# Altium schematic sheet root.SchDoc
size A4
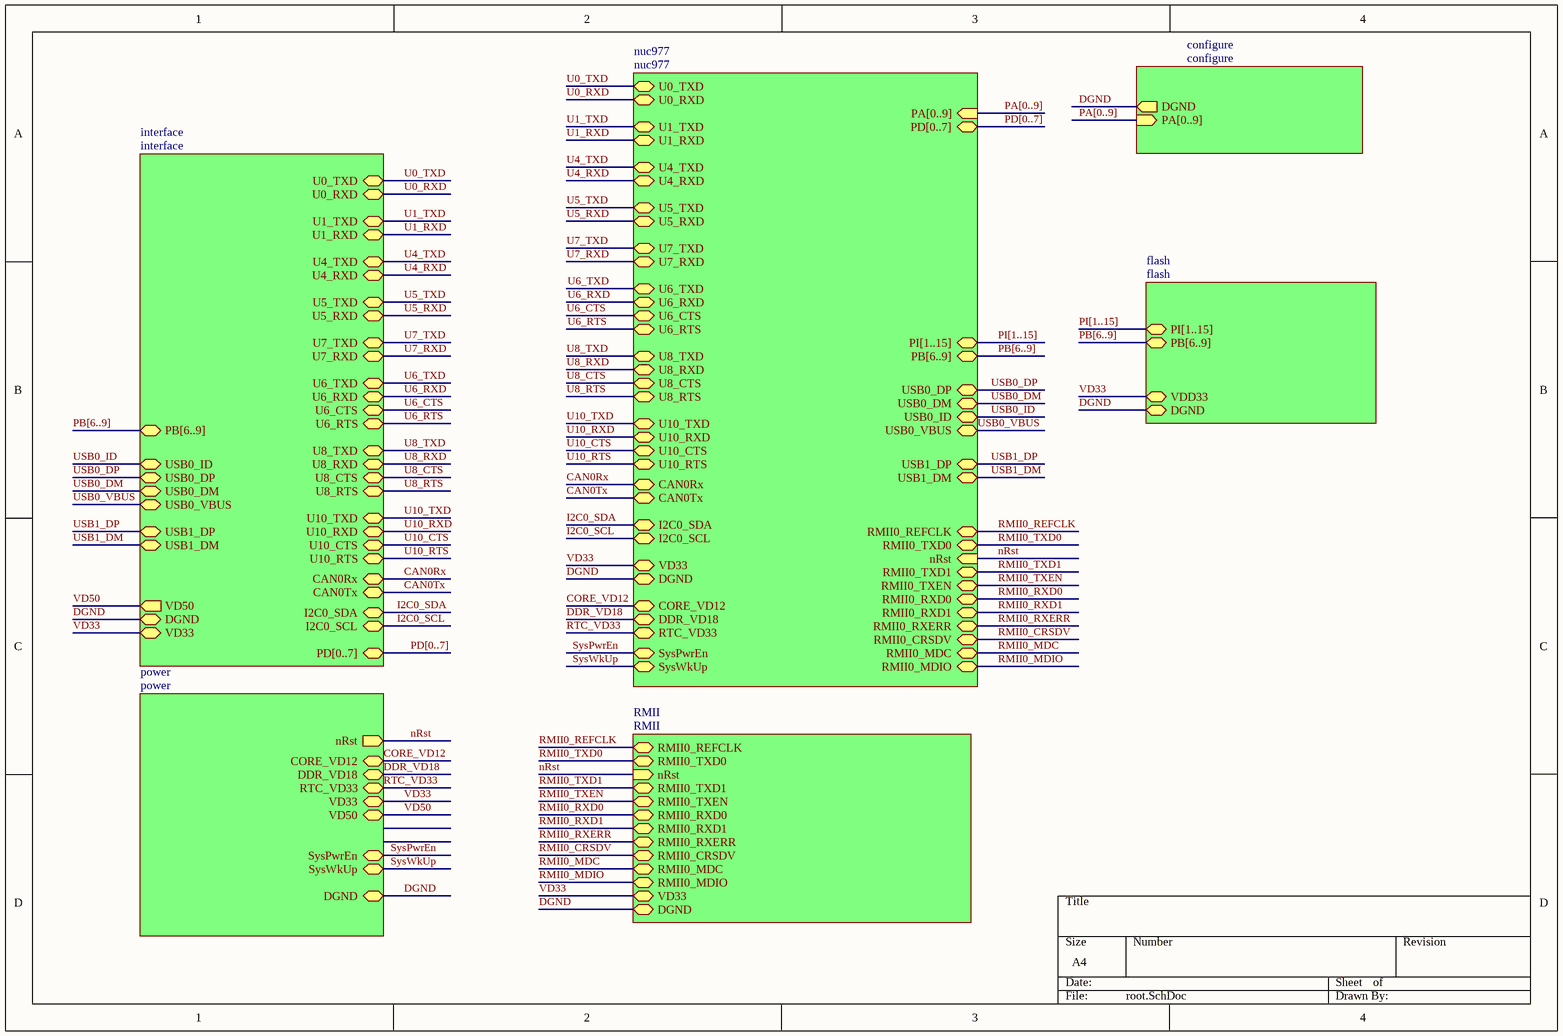
[diagram p0: root.SchDoc]

## Sub-sheets
configure = configure: PA[0..9] (in), DGND (out)
flash = flash: DGND, VDD33, PI[1..15], PB[6..9]
interface = interface: U0_RXD, U0_TXD, U1_TXD, U1_RXD, U4_RXD, U4_TXD, U5_TXD, U5_RXD, U7_TXD, U7_RXD, U6_TXD, U6_RXD, U6_CTS, U6_RTS, U8_TXD, U8_RXD, U8_CTS, U8_RTS, U10_TXD, U10_RXD, U10_CTS, U10_RTS, CAN0Rx, CAN0Tx, I2C0_SDA, I2C0_SCL, DGND, VD33, USB0_DP, USB0_DM, USB0_ID, USB1_DP, USB1_DM, USB0_VBUS, VD50 (out), PD[0..7], PB[6..9]
nuc977 = nuc977: CORE_VD12, RTC_VD33, DDR_VD18, SysPwrEn (bidir), SysWkUp (bidir), VD33, DGND, U0_RXD, U0_TXD, U1_TXD, U1_RXD, U4_RXD, U4_TXD, U5_TXD, U5_RXD, U7_TXD, U7_RXD, U6_TXD, U6_RXD, U6_CTS, U6_RTS, U8_TXD, U8_RXD, U8_CTS, U8_RTS, U10_TXD, U10_RXD, U10_CTS, U10_RTS, CAN0Rx, CAN0Tx, I2C0_SDA, I2C0_SCL, USB0_DP, USB0_DM, PI[1..15], PB[6..9], RMII0_REFCLK, RMII0_TXD0, nRst (in), RMII0_TXD1, RMII0_TXEN, RMII0_RXD0, RMII0_RXD1, RMII0_RXERR, RMII0_CRSDV, RMII0_MDC, RMII0_MDIO, PA[0..9] (in), PD[0..7], USB0_ID, USB1_DP, USB1_DM, USB0_VBUS
power = power: CORE_VD12, RTC_VD33, DDR_VD18, SysPwrEn (bidir), SysWkUp (bidir), VD33, DGND, VD50, nRst (out)
RMII = RMII: RMII0_REFCLK, RMII0_TXD0, nRst (in), RMII0_TXD1, RMII0_TXEN, RMII0_RXD0, RMII0_RXD1, RMII0_RXERR, RMII0_CRSDV, RMII0_MDC, RMII0_MDIO, VD33, DGND

## Nets
CAN0Rx: sheet nuc977/CAN0Rx, sheet interface/CAN0Rx
CAN0Tx: sheet nuc977/CAN0Tx, sheet interface/CAN0Tx
CORE_VD12: sheet nuc977/CORE_VD12, sheet power/CORE_VD12
DDR_VD18: sheet nuc977/DDR_VD18, sheet power/DDR_VD18
DGND: sheet nuc977/DGND, sheet power/DGND, sheet flash/DGND, sheet interface/DGND, sheet configure/DGND, sheet RMII/DGND
I2C0_SCL: sheet nuc977/I2C0_SCL, sheet interface/I2C0_SCL
I2C0_SDA: sheet nuc977/I2C0_SDA, sheet interface/I2C0_SDA
nRst: sheet nuc977/nRst, sheet power/nRst, sheet RMII/nRst
RMII0_CRSDV: sheet nuc977/RMII0_CRSDV, sheet RMII/RMII0_CRSDV
RMII0_MDC: sheet nuc977/RMII0_MDC, sheet RMII/RMII0_MDC
RMII0_MDIO: sheet nuc977/RMII0_MDIO, sheet RMII/RMII0_MDIO
RMII0_REFCLK: sheet nuc977/RMII0_REFCLK, sheet RMII/RMII0_REFCLK
RMII0_RXD0: sheet nuc977/RMII0_RXD0, sheet RMII/RMII0_RXD0
RMII0_RXD1: sheet nuc977/RMII0_RXD1, sheet RMII/RMII0_RXD1
RMII0_RXERR: sheet nuc977/RMII0_RXERR, sheet RMII/RMII0_RXERR
RMII0_TXD0: sheet nuc977/RMII0_TXD0, sheet RMII/RMII0_TXD0
RMII0_TXD1: sheet nuc977/RMII0_TXD1, sheet RMII/RMII0_TXD1
RMII0_TXEN: sheet nuc977/RMII0_TXEN, sheet RMII/RMII0_TXEN
RTC_VD33: sheet nuc977/RTC_VD33, sheet power/RTC_VD33
SysPwrEn: sheet nuc977/SysPwrEn, sheet power/SysPwrEn
SysWkUp: sheet nuc977/SysWkUp, sheet power/SysWkUp
U0_RXD: sheet nuc977/U0_RXD, sheet interface/U0_RXD
U0_TXD: sheet nuc977/U0_TXD, sheet interface/U0_TXD
U1_RXD: sheet nuc977/U1_RXD, sheet interface/U1_RXD
U1_TXD: sheet nuc977/U1_TXD, sheet interface/U1_TXD
U4_RXD: sheet nuc977/U4_RXD, sheet interface/U4_RXD
U4_TXD: sheet nuc977/U4_TXD, sheet interface/U4_TXD
U5_RXD: sheet nuc977/U5_RXD, sheet interface/U5_RXD
U5_TXD: sheet nuc977/U5_TXD, sheet interface/U5_TXD
U6_CTS: sheet nuc977/U6_CTS, sheet interface/U6_CTS
U6_RTS: sheet nuc977/U6_RTS, sheet interface/U6_RTS
U6_RXD: sheet nuc977/U6_RXD, sheet interface/U6_RXD
U6_TXD: sheet nuc977/U6_TXD, sheet interface/U6_TXD
U7_RXD: sheet nuc977/U7_RXD, sheet interface/U7_RXD
U7_TXD: sheet nuc977/U7_TXD, sheet interface/U7_TXD
U8_CTS: sheet nuc977/U8_CTS, sheet interface/U8_CTS
U8_RTS: sheet nuc977/U8_RTS, sheet interface/U8_RTS
U8_RXD: sheet nuc977/U8_RXD, sheet interface/U8_RXD
U8_TXD: sheet nuc977/U8_TXD, sheet interface/U8_TXD
U10_CTS: sheet nuc977/U10_CTS, sheet interface/U10_CTS
U10_RTS: sheet nuc977/U10_RTS, sheet interface/U10_RTS
U10_RXD: sheet nuc977/U10_RXD, sheet interface/U10_RXD
U10_TXD: sheet nuc977/U10_TXD, sheet interface/U10_TXD
USB0_DM: sheet nuc977/USB0_DM, sheet interface/USB0_DM
USB0_DP: sheet nuc977/USB0_DP, sheet interface/USB0_DP
USB0_ID: sheet nuc977/USB0_ID, sheet interface/USB0_ID
USB0_VBUS: sheet nuc977/USB0_VBUS, sheet interface/USB0_VBUS
USB1_DM: sheet nuc977/USB1_DM, sheet interface/USB1_DM
USB1_DP: sheet nuc977/USB1_DP, sheet interface/USB1_DP
VD33: sheet nuc977/VD33, sheet power/VD33, sheet flash/VDD33, sheet interface/VD33, sheet RMII/VD33
VD50: sheet power/VD50, sheet interface/VD50

## Buses and harness runs
bus PA[0..9] = sheet configure/PA[0..9]
bus PA[0..9] = sheet nuc977/PA[0..9]
bus PB[6..9] = sheet flash/PB[6..9]
bus PB[6..9] = sheet interface/PB[6..9]
bus PB[6..9] = sheet nuc977/PB[6..9]
bus PD[0..7] = sheet interface/PD[0..7]
bus PD[0..7] = sheet nuc977/PD[0..7]
bus PI[1..15] = sheet flash/PI[1..15]
bus PI[1..15] = sheet nuc977/PI[1..15]